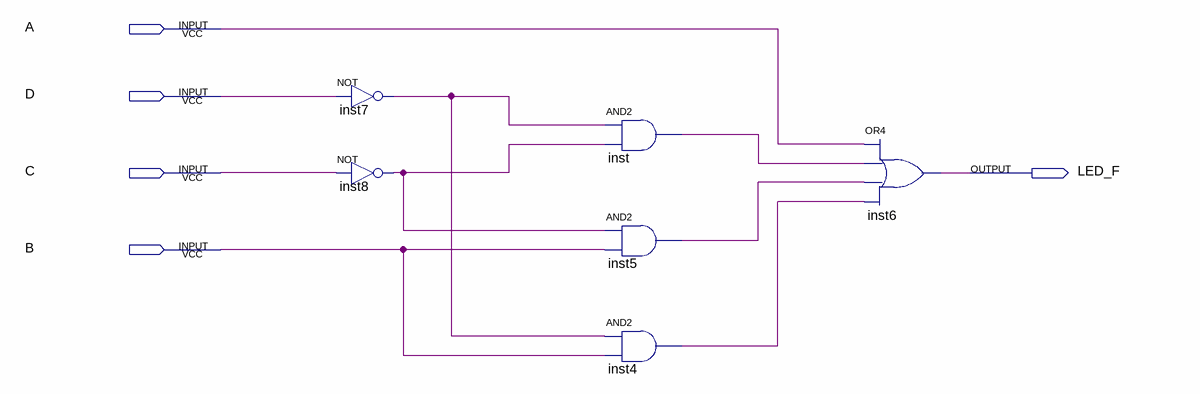
[diagram p0: schematic sheet]
// Quartus schematic led_f.bdf as structural Verilog: 6 symbols, 5 pins
module led_f (
  input  A,
  input  D,
  input  C,
  input  B,
  output LED_F
);

  wire inst4_out, inst5_out, inst7_out, inst8_out, inst_out;

  not inst7 (inst7_out, D);
  not inst8 (inst8_out, C);
  and inst (inst_out, inst7_out, inst8_out);
  and inst5 (inst5_out, inst8_out, B);
  and inst4 (inst4_out, inst7_out, B);
  or inst6 (LED_F, A, inst_out, inst5_out, inst4_out);
endmodule
